# Altium schematic sheet Mechanic.SchDoc: Mechanic
size A4; Author: Eladio Delgado Mingorance; CompanyName: bq - Mundo Reader; Organization: bq - Mundo Reader; Revision: 1.4; SheetNumber: 10; SheetTotal: 10
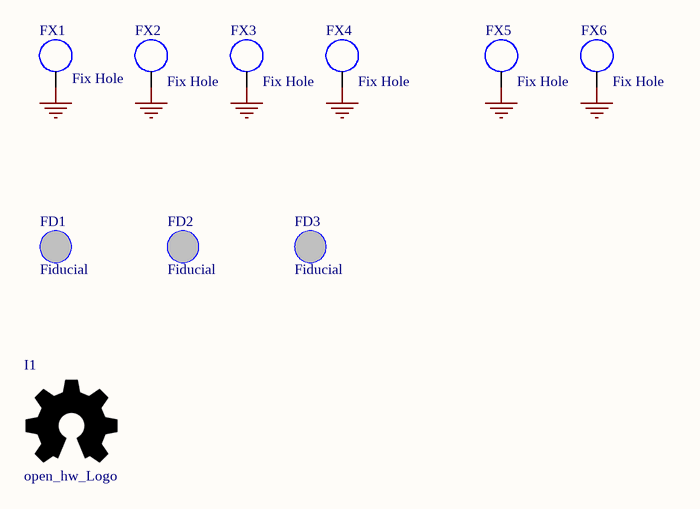
[diagram p0: Mechanic.SchDoc]

## Parts
FD1  Fiducial  [Fiducial]  (no BOM)
FD2  Fiducial  [Fiducial]  (no BOM)
FD3  Fiducial  [Fiducial]  (no BOM)
FX1  Fix Hole  [Fix_Hole_3mm_5mmPad]  (no BOM)
FX2  Fix Hole  [Fix_Hole_3mm_5mmPad]  (no BOM)
FX3  Fix Hole  [Fix_Hole_3mm_5mmPad]  (no BOM)
FX4  Fix Hole  [Fix_Hole_3mm_5mmPad]  (no BOM)
FX5  Fix Hole  [Fix_Hole_3mm]  (no BOM)
FX6  Fix Hole  [Fix_Hole_3mm]  (no BOM)
I1  open_hw_Logo  [open_hw_Logo_small]  (no BOM)

## Nets
GND: FX1.1 FX2.1 FX3.1 FX4.1 FX5.1 FX6.1

## Notes on the sheet
- Title
- Project
- Size:
- Author
- A4
- Number:
- Revision:
- Mundo Reader, S.L. This project and all the sheets and layouts enclosed are licensed under Creative Commons by Attribution and Share Alike [CC BY-SA] (www.creativecommons.com)
- Date:
- Time:
- Sheet
- of

## Library data of the parts
FX1-FX4 = FX_3_5pad: Part Number: FX_3_5pad
FX5 FX6 = FX_3: Part Number: FX_3
I1 = Open HW Logo Small: Part Number: Open HW Logo Small
FD1-FD3 = Fiducial: Part Number: Fiducial